# Altium schematic sheet Sheet3.SchDoc
size A4; SheetNumber: 3; SheetTotal: 3
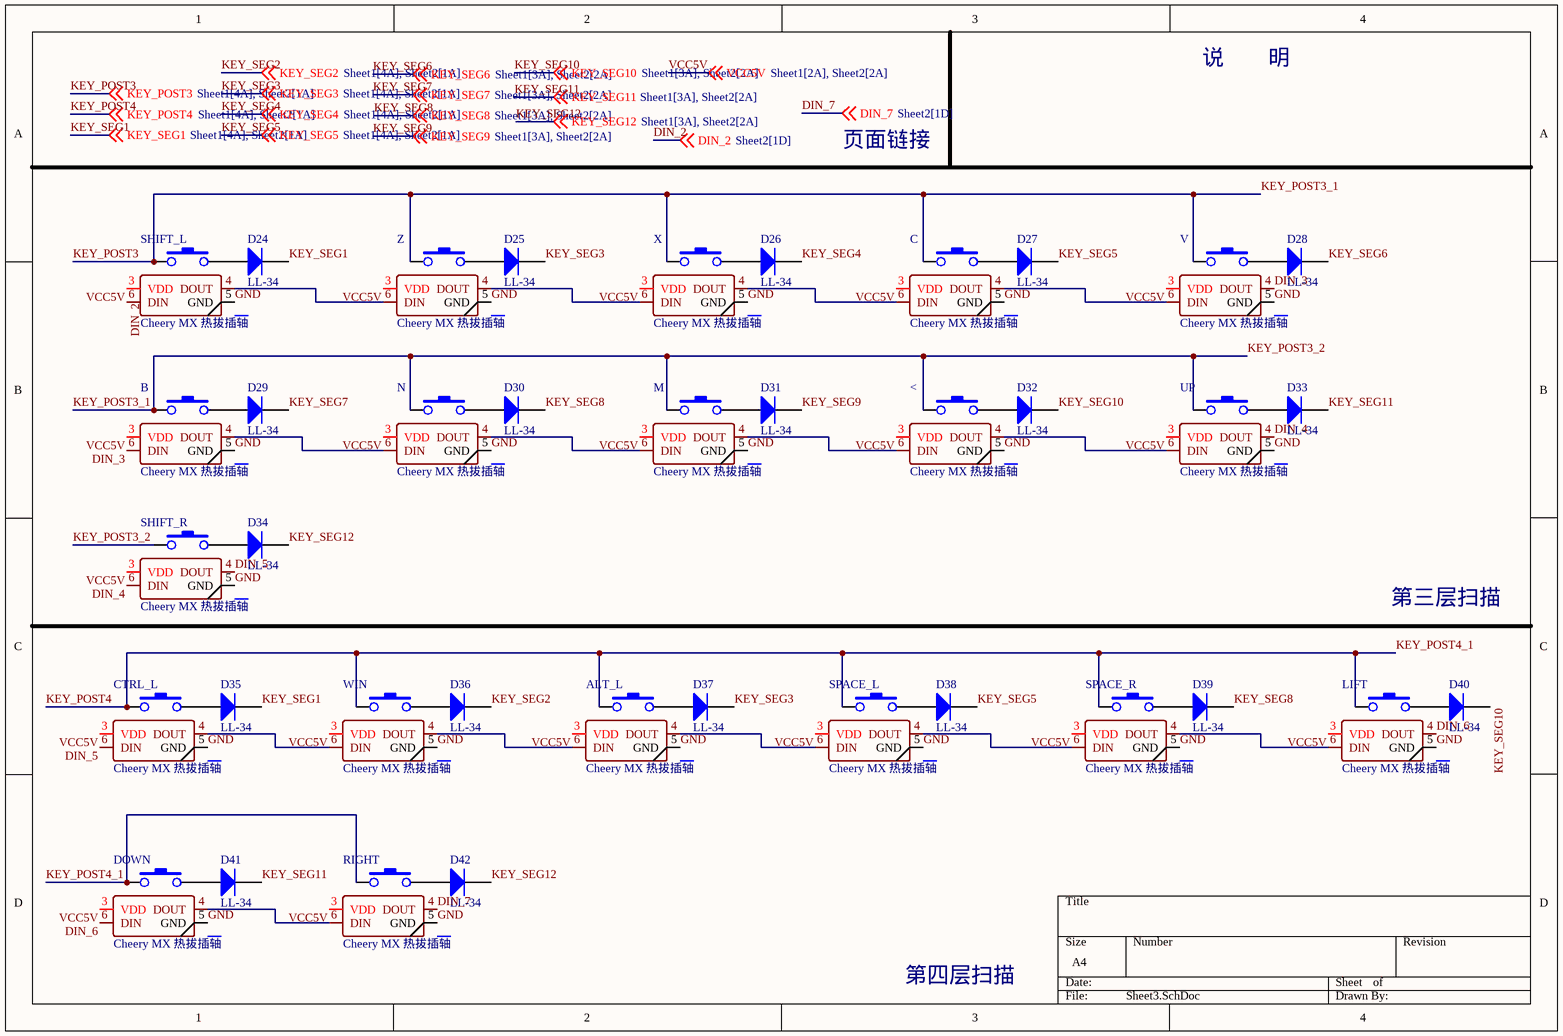
[diagram p0: Sheet3.SchDoc]

## Parts
<  Cheery MX 热拔插轴  [MX_SW-HOTPLUG]
ALT_L  Cheery MX 热拔插轴  [MX_SW-HOTPLUG]
B  Cheery MX 热拔插轴  [MX_SW-HOTPLUG]
C  Cheery MX 热拔插轴  [MX_SW-HOTPLUG]
CTRL_L  Cheery MX 热拔插轴  [MX_SW-HOTPLUG]
D24  LL-34  [LL-34_L3.7-W1.6-RD]
D25  LL-34  [LL-34_L3.7-W1.6-RD]
D26  LL-34  [LL-34_L3.7-W1.6-RD]
D27  LL-34  [LL-34_L3.7-W1.6-RD]
D28  LL-34  [LL-34_L3.7-W1.6-RD]
D29  LL-34  [LL-34_L3.7-W1.6-RD]
D30  LL-34  [LL-34_L3.7-W1.6-RD]
D31  LL-34  [LL-34_L3.7-W1.6-RD]
D32  LL-34  [LL-34_L3.7-W1.6-RD]
D33  LL-34  [LL-34_L3.7-W1.6-RD]
D34  LL-34  [LL-34_L3.7-W1.6-RD]
D35  LL-34  [LL-34_L3.7-W1.6-RD]
D36  LL-34  [LL-34_L3.7-W1.6-RD]
D37  LL-34  [LL-34_L3.7-W1.6-RD]
D38  LL-34  [LL-34_L3.7-W1.6-RD]
D39  LL-34  [LL-34_L3.7-W1.6-RD]
D40  LL-34  [LL-34_L3.7-W1.6-RD]
D41  LL-34  [LL-34_L3.7-W1.6-RD]
D42  LL-34  [LL-34_L3.7-W1.6-RD]
DOWN  Cheery MX 热拔插轴  [MX_SW-HOTPLUG]
LIFT  Cheery MX 热拔插轴  [MX_SW-HOTPLUG]
M  Cheery MX 热拔插轴  [MX_SW-HOTPLUG]
N  Cheery MX 热拔插轴  [MX_SW-HOTPLUG]
RIGHT  Cheery MX 热拔插轴  [MX_SW-HOTPLUG]
SHIFT_L  Cheery MX 热拔插轴  [MX_SW-HOTPLUG]
SHIFT_R  Cheery MX 热拔插轴  [MX_SW-HOTPLUG]
SPACE_L  Cheery MX 热拔插轴  [MX_SW-HOTPLUG]
SPACE_R  Cheery MX 热拔插轴  [MX_SW-HOTPLUG]
UP  Cheery MX 热拔插轴  [MX_SW-HOTPLUG]
V  Cheery MX 热拔插轴  [MX_SW-HOTPLUG]
WIN  Cheery MX 热拔插轴  [MX_SW-HOTPLUG]
X  Cheery MX 热拔插轴  [MX_SW-HOTPLUG]
Z  Cheery MX 热拔插轴  [MX_SW-HOTPLUG]

## Nets
DIN_2: SHIFT_L.6(DIN) ; off-sheet DIN_2
DIN_3: B.6(DIN) V.4(DOUT)
DIN_4: SHIFT_R.6(DIN) UP.4(DOUT)
DIN_5: CTRL_L.6(DIN) SHIFT_R.4(DOUT)
DIN_6: DOWN.6(DIN) LIFT.4(DOUT)
DIN_7: RIGHT.4(DOUT) ; off-sheet DIN_7
GND: <.5(GND) ALT_L.5(GND) B.5(GND) C.5(GND) CTRL_L.5(GND) DOWN.5(GND) LIFT.5(GND) M.5(GND) N.5(GND) RIGHT.5(GND) SHIFT_L.5(GND) SHIFT_R.5(GND) SPACE_L.5(GND) SPACE_R.5(GND) UP.5(GND) V.5(GND) WIN.5(GND) X.5(GND) Z.5(GND)
KEY_POST3: <.1 B.1 C.1 M.1 N.1 SHIFT_L.1 SHIFT_R.1 UP.1 V.1 X.1 Z.1 ; off-sheet KEY_POST3  [also labelled KEY_POST3_1, KEY_POST3_2]
KEY_POST4: ALT_L.1 CTRL_L.1 DOWN.1 LIFT.1 RIGHT.1 SPACE_L.1 SPACE_R.1 WIN.1 ; off-sheet KEY_POST4  [also labelled KEY_POST4_1]
KEY_SEG1: D24.2(K) D35.2(K) ; off-sheet KEY_SEG1
KEY_SEG2: D36.2(K) ; off-sheet KEY_SEG2
KEY_SEG3: D25.2(K) D37.2(K) ; off-sheet KEY_SEG3
KEY_SEG4: D26.2(K) ; off-sheet KEY_SEG4
KEY_SEG5: D27.2(K) D38.2(K) ; off-sheet KEY_SEG5
KEY_SEG6: D28.2(K) ; off-sheet KEY_SEG6
KEY_SEG7: D29.2(K) ; off-sheet KEY_SEG7
KEY_SEG8: D30.2(K) D39.2(K) ; off-sheet KEY_SEG8
KEY_SEG9: D31.2(K) ; off-sheet KEY_SEG9
KEY_SEG10: D32.2(K) D40.2(K) ; off-sheet KEY_SEG10
KEY_SEG11: D33.2(K) D41.2(K) ; off-sheet KEY_SEG11
KEY_SEG12: D34.2(K) D42.2(K) ; off-sheet KEY_SEG12
VCC5V: <.3(VDD) ALT_L.3(VDD) B.3(VDD) C.3(VDD) CTRL_L.3(VDD) DOWN.3(VDD) LIFT.3(VDD) M.3(VDD) N.3(VDD) RIGHT.3(VDD) SHIFT_L.3(VDD) SHIFT_R.3(VDD) SPACE_L.3(VDD) SPACE_R.3(VDD) UP.3(VDD) V.3(VDD) WIN.3(VDD) X.3(VDD) Z.3(VDD) ; off-sheet VCC5V
Net<_2: <.2 D32.1(A)
Net<_4: <.4(DOUT) UP.6(DIN)
Net<_6: <.6(DIN) M.4(DOUT)
NetALT_L_2: ALT_L.2 D37.1(A)
NetALT_L_4: ALT_L.4(DOUT) SPACE_L.6(DIN)
NetALT_L_6: ALT_L.6(DIN) WIN.4(DOUT)
NetB_2: B.2 D29.1(A)
NetB_4: B.4(DOUT) N.6(DIN)
NetC_2: C.2 D27.1(A)
NetC_4: C.4(DOUT) V.6(DIN)
NetC_6: C.6(DIN) X.4(DOUT)
NetCTRL_L_2: CTRL_L.2 D35.1(A)
NetCTRL_L_4: CTRL_L.4(DOUT) WIN.6(DIN)
NetD24_1: D24.1(A) SHIFT_L.2
NetD25_1: D25.1(A) Z.2
NetD26_1: D26.1(A) X.2
NetD28_1: D28.1(A) V.2
NetD30_1: D30.1(A) N.2
NetD31_1: D31.1(A) M.2
NetD33_1: D33.1(A) UP.2
NetD34_1: D34.1(A) SHIFT_R.2
NetD36_1: D36.1(A) WIN.2
NetD38_1: D38.1(A) SPACE_L.2
NetD39_1: D39.1(A) SPACE_R.2
NetD40_1: D40.1(A) LIFT.2
NetD41_1: D41.1(A) DOWN.2
NetD42_1: D42.1(A) RIGHT.2
NetDOWN_4: DOWN.4(DOUT) RIGHT.6(DIN)
NetLIFT_6: LIFT.6(DIN) SPACE_R.4(DOUT)
NetM_6: M.6(DIN) N.4(DOUT)
NetSHIFT_L_4: SHIFT_L.4(DOUT) Z.6(DIN)
NetSPACE_L_4: SPACE_L.4(DOUT) SPACE_R.6(DIN)
NetX_6: X.6(DIN) Z.4(DOUT)

## Notes on the sheet
- 说        明
- 页面链接
- 第三层扫描
- 第四层扫描

## Library data of the parts
< ALT_L B C CTRL_L DOWN LIFT M N RIGHT SHIFT_L SHIFT_R SPACE_L SPACE_R UP V WIN X Z = Cheery MX 热拔插轴: 机械键盘轴（Cheery MX）
D24-D42 = LL4148: 开关二极管（Switching diode）; Published: 8-Jun-2000; LatestRevisionDate: 17-Jul-2002; LatestRevisionNote: Re-released for DXP Platform.; PackageVersion: Sep-1996; PackageReference: SMC; Publisher: Altium Limited; PackageDescription: DO-214-AB/SMC; 2 C-Bend Leads; Body 7.9 x 5.9 mm, inc. leads (LxW); Code_JEDEC: DO-214-AB